# EAGLE design ledtester (EAGLE 5.10)
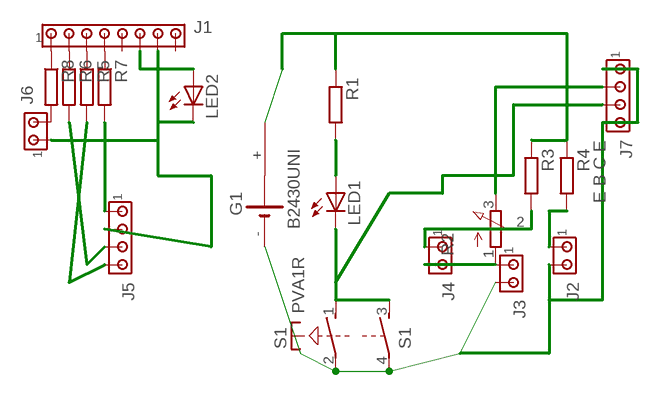
[diagram p0: schematic, sheet 1]

## Parts
G1  B2430UNI  [B2430UNI]
J1  MTA08-100  [10X08MTA]
J2  MTA02-100  [10X02MTA]
J3  MTA02-100  [10X02MTA]
J4  MTA02-100  [10X02MTA]
J5  MTA04-100  [10X04MTA]
J6  MTA02-100  [10X02MTA]
J7  E B C E  MTA04-100  [10X04MTA]
LED1  LEDIRL80A  [IRL80A]
LED2  LED3MM  [LED3MM]
R1  R-EU_0309/12  [0309/12]
R2  3RP/1610N  [3RP/1610N]
R3  R-EU_0309/12  [0309/12]
R4  R-EU_0309/12  [0309/12]
R5  R-EU_0309/12  [0309/12]
R6  R-EU_0309/12  [0309/12]
R7  R-EU_0309/12  [0309/12]
R8  R-EU_0309/12  [0309/12]
S1  PVA1R  [PVA1R]

## Nets
AGND: J1.7 J5.2 J6.1 LED2.K(C)
GND: G1.- J2.2 J3.2 J7.1 J7.4 S1.2(1:P) S1.4(2:P)
N$1: J1.3 R5.1
N$2: J1.2 R6.1
N$3: LED1.A R1.2
N$4: J4.1 R2.2(S) R3.2
N$5: J7.2 R2.3(E)
N$6: J3.1 J4.2 R2.1(A)
N$7: J7.3 LED1.K(C) S1.1(1:S) S1.3(2:S)
N$8: J2.1 R4.2
N$9: J1.4 R7.1
N$10: J1.6 LED2.A
N$11: J1.1 R8.1
N$14: J5.1 R7.2
N$15: J5.3 R6.2
N$16: J5.4 R5.2
N$18: J6.2 R8.2
PWD: G1.+ R1.1 R3.1 R4.1
Unconnected: G1.+@1(+) G1.+@2(+) G1.+@3(+) G1.+@4(+) G1.-@1(-) J1.5 J1.8

## Library data of the parts
G1 = battery:B2430UNI: LI BATTERY
J1 = con-amp:MTA08-100: AMP connector
J2-J4 J6 = con-amp:MTA02-100: AMP connector
J5 J7 = con-amp:MTA04-100: AMP connector
LED1 = adafruit:LED: LED
LED2 = led:LED: LED
R1 R3-R8 = resistor:R-EU_: RESISTOR, European symbol
R2 = pot:3RP/1610N: 16mm Potentiometer one level Source: http://www.alphapotentiometers.net/html/16mm_pot_2.html
S1 = switch-misc:PVA1R: ITT SWITCH

## Net classes
1 high voltage: width 3.81 mm, drill 1.016 mm, clearance 3.81 mm

## Board
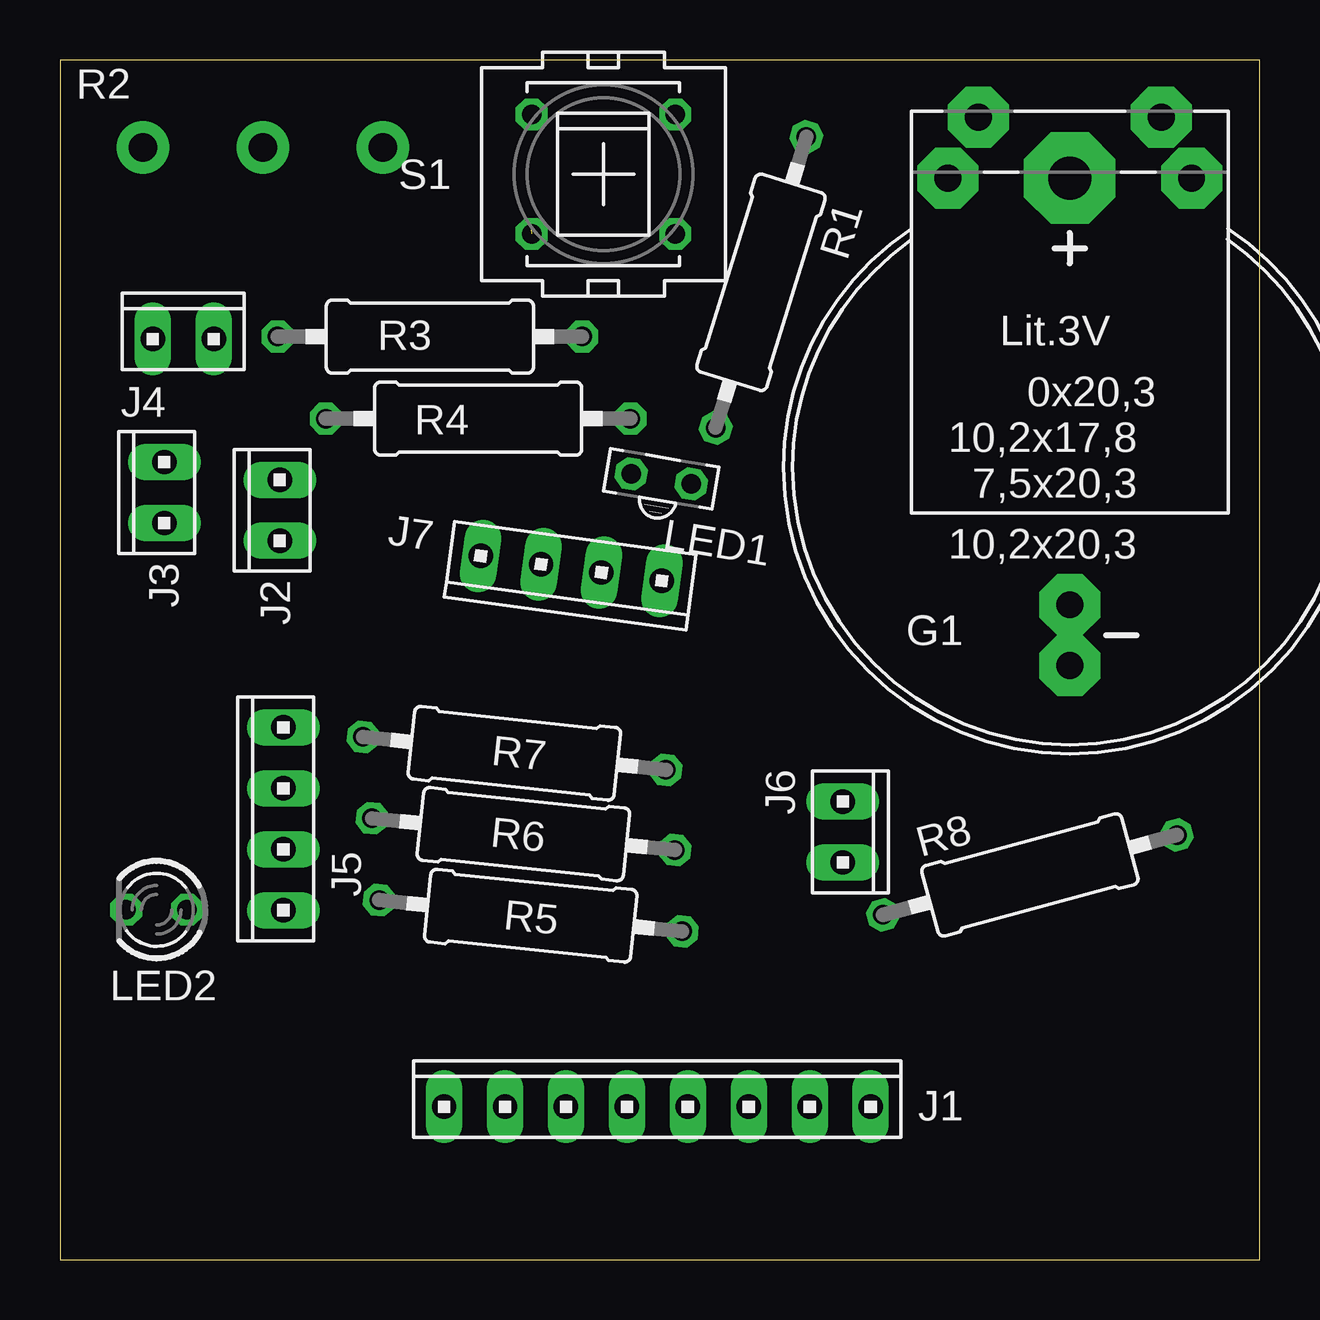
[diagram p1: board, top side]
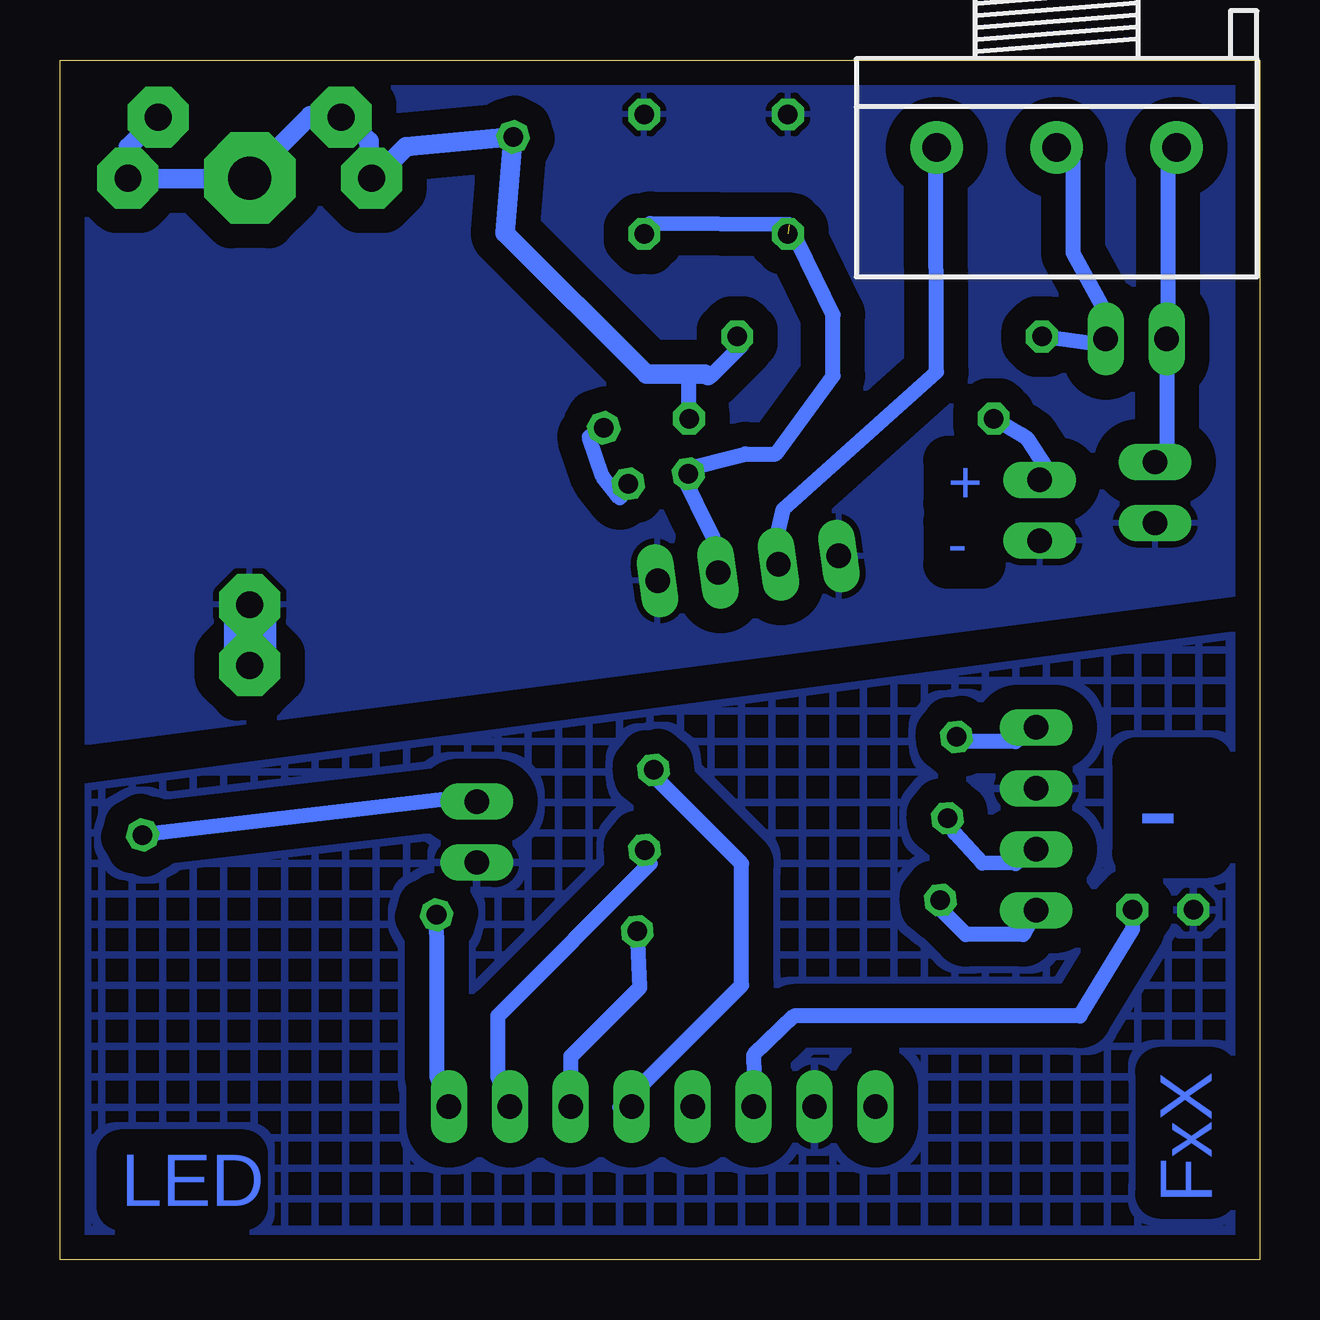
[diagram p2: board, bottom side, seen from below]

Size 50 x 50 mm. Coordinates in mm from the lower left corner, seen from the top.
Outline: 0,0 50,0 50,50 0,50 0,0
Copper layers (1*16): Top 0.035mm / dielectric 1.5mm / Bottom 0.035mm
Design rules "default *": minimum track width 25mil, minimum drill 24mil, track to track 20mil, track to pad 8mil, pad to pad 8mil, via to via 8mil, smd to smd 8mil, copper to edge 40mil, drill to drill 8mil, minimum pad ring 10mil, minimum via ring 8mil, stop-mask expansion 4mil, vias tented up to drill 0mil, thermal gap 10mil

### Footprints (pad centres in the part's own frame; a part is rotated, then mirrored left to right if it is on the bottom)
B2430UNI = drill 1.118 pad 2.54 octagon: + 3.81,14.605; +@1 -3.81,14.605; +@2 -5.08,12.065; +@3 5.08,12.065; - 0,-5.715; -@1 0,-8.255 | drill 1.803 pad 3.81 octagon: +@4 0,12.065
10X08MTA = drill 1.016 long: 1 8.89,0; 2 6.35,0; 3 3.81,0; 4 1.27,0; 5 -1.27,0; 6 -3.81,0; 7 -6.35,0; 8 -8.89,0
10X02MTA = drill 1.016 long: 1 1.27,0; 2 -1.27,0
10X04MTA = drill 1.016 long: 1 3.81,0; 2 1.27,0; 3 -1.27,0; 4 -3.81,0
IRL80A = drill 0.813 octagon: A 0,-1.27; K 0,1.27
LED3MM = drill 0.813 octagon: A -1.27,0; K 1.27,0
0309/12 = drill 0.813 octagon: 1 -6.35,0; 2 6.35,0
3RP/1610N = drill 1.2 pad 2.184 round: 1 -5,0; 2 0,0; 3 5,0
PVA1R = drill 0.813 octagon: 1 -2.997,2.489; 2 -2.997,-2.489; 3 2.997,2.489; 4 2.997,-2.489

### Placement (x,y rotation side)
G1  42.09,33.01 0 top
J1  24.9,6.37 0 top
J2  9.16,31.23 90 top
J3  4.35,31.97 90 top
J4  5.14,38.37 0 top
J5  9.31,18.37 90 top
J6  32.63,17.82 270 top
J7  21.31,28.81 172.2 top
LED1  25.06,32.54 80.5 top
LED2  4.03,14.58 180 top
R1  29.22,40.73 252.7 top
R2  8.46,46.35 180 bottom
R3  15.42,38.47 180 top
R4  17.43,35.05 180 top
R5  19.62,14.33 174.1 top
R6  19.32,17.73 174 top
R7  18.94,21.1 173.8 top
R8  40.43,16.03 15.2 top
S1  22.65,45.24 180 top

### Tracks (layer width: path | path; a pad name or v marks a point on that pad's centre or on a via)
AGND
  pour Bottom (isolate 1.016, hatched): 0.02,26.18 0.05,0.12 49.72,0.57 50.05,19.56
GND
  Bottom 0.635: 42.07,26.67 41.91,26.67 G1.-
  Bottom 2.184: 42.14,27.02 42.07,27.02 42.07,26.67 42.07,24.88
  pour Bottom (isolate 1.016): 0,50 0.04,27.87 50,21.41 50,50
N$1
  Bottom 0.635: R5.1 25.83,11.34 28.7,8.47 J1.3
N$2
  Bottom 0.635: R6.1 25.4,16.51 31.75,10.16 31.75,7.62 J1.2
N$3
  Bottom 0.635: LED1.A 26.67,31.75 27.38,32.64 27.94,34.29 R1.2
N$4
  Bottom 0.635: R3.2 6.35,38.1 J4.1 6.35,39.37 7.77,41.95 7.77,45.76 R2.2
N$5
  Bottom 0.635: 20.32,27.94 J7.2 20.32,29.21 19.85,31.28 13.46,37 13.48,45.61 R2.3
N$6
  Bottom 0.635: J3.1 3.85,33.39 3.85,38.1 J4.2 3.81,39.37 3.81,45.72 R2.1
N$7  (1 unrouted)
  Bottom 0.635: 24.16,32.88 22.76,30.05 22.86,27.94 J7.3 | 24.16,32.88 21.43,33.58 20.16,33.58 17.78,36.83 17.78,39.37 19.62,43.14 25.4,43.18 S1.1 | 24.16,32.88 LED1.K
N$8
  Bottom 0.635: R4.2 9.94,34.39 9.66,34.2 8.89,33.02 J2.1
N$9
  Bottom 0.635: R7.1 25.4,20.32 21.59,16.51 21.59,11.43 26.67,6.35 J1.4
N$10
  Bottom 0.635: LED2.A 5.29,13.78 7.48,10.15 19.4,10.15 21.09,8.53 21.08,7.69 J1.6
N$11
  Bottom 0.635: R8.1 34.29,12.7 34.29,7.62 J1.1
N$14
  Bottom 0.635: R7.2 12.7,21.59 10.16,21.59 J5.1
N$15
  Bottom 0.635: R6.2 12.7,17.78 11.56,16.53 10.16,16.51 J5.3
N$16
  Bottom 0.635: R5.2 13.19,14.5 12.24,13.55 9.85,13.55 J5.4
N$18
  Bottom 0.635: R8.2 45.71,17.81 33.44,19.25 J6.2
PWD
  Bottom 0.635: R4.1 23.79,36.91 22.99,36.85 22.86,36.83 21.59,38.1 R3.1
  Bottom 0.813: 22.99,36.85 23.12,36.91 23.79,36.91 25.56,36.91 31.44,42.79 R1.1 35.58,46.39 37.11,44.86 37.11,46.61 38.18,47.68 39.58,47.68 42.2,45.06 46.96,45.06 47.16,45.26 47.16,46.35 G1.+

### Text on the board
Bottom: + | - | - | FxX | LED